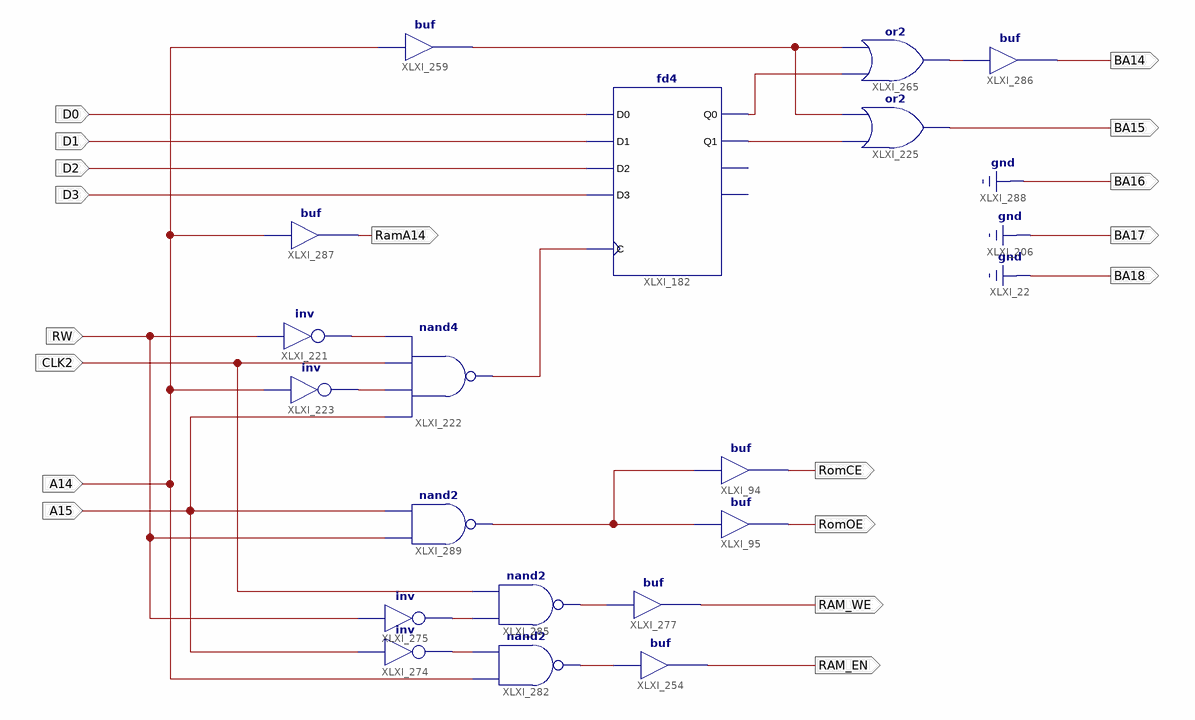
[diagram p0: schematic sheet 1]
// Xilinx ISE schematic A78maxi128kTOWER.sch (xc9500xl) as structural Verilog: 18 symbols, 18 ports
module A78maxi128kTOWER (
  input  D0,
  input  D1,
  input  D2,
  input  A14,
  input  D3,
  input  CLK2,
  input  RW,
  input  A15,
  output BA18,
  output BA17,
  output BA16,
  output RomCE,
  output RomOE,
  output RAM_WE,
  output BA15,
  output RAM_EN,
  output BA14,
  output RamA14
);

  wire XLXN_335, XLXN_336, XLXN_346, XLXN_347, XLXN_400, XLXN_411, XLXN_412, XLXN_420, XLXN_423, XLXN_424,
       XLXN_426, XLXN_427;

  fd4 XLXI_182 (.C(XLXN_411), .D0(D0), .D1(D1), .D2(D2), .D3(D3), .Q0(XLXN_347), .Q1(XLXN_346));  // open: Q2, Q3
  buf XLXI_95 (RomOE, XLXN_420);
  buf XLXI_94 (RomCE, XLXN_420);
  not XLXI_221 (XLXN_335, RW);
  nand XLXI_222 (XLXN_411, A15, XLXN_336, CLK2, XLXN_335);
  not XLXI_223 (XLXN_336, A14);
  buf XLXI_254 (RAM_EN, XLXN_424);
  buf XLXI_259 (XLXN_400, A14);
  or XLXI_265 (XLXN_412, XLXN_347, XLXN_400);
  not XLXI_274 (XLXN_423, A15);
  not XLXI_275 (XLXN_426, RW);
  buf XLXI_277 (RAM_WE, XLXN_427);
  nand XLXI_282 (XLXN_424, A14, XLXN_423);
  nand XLXI_285 (XLXN_427, XLXN_426, CLK2);
  buf XLXI_286 (BA14, XLXN_412);
  buf XLXI_287 (RamA14, A14);
  or XLXI_225 (BA15, XLXN_346, XLXN_400);
  nand XLXI_289 (XLXN_420, RW, A15);

  assign BA16 = 1'b0;
  assign BA17 = 1'b0;
  assign BA18 = 1'b0;

  // Notes on the sheet:
  //   LOC on signal D0 = 23
  //   LOC on signal D1 = 22
  //   LOC on signal D2 = 21
  //   LOC on signal BA18 = 39
  //   LOC on signal A14 = 37
  //   LOC on signal D3 = 20
  //   LOC on signal CLK2 = 44
  //   LOC on signal RW = 43
  //   LOC on signal BA17 = 41
  //   LOC on signal BA16 = 38
  //   LOC on signal A15 = 36
  //   LOC on signal RomCE = 8
  //   LOC on signal RomOE = 18
  //   LOC on signal RAM_WE = 40
  //   LOC on signal BA15 = 33
  //   LOC on signal RAM_EN = 7
  //   LOC on signal BA14 = 42
  //   LOC on signal RamA14 = 6
endmodule
